# Altium schematic sheet mlx-brd1_091-sensor.SchDoc
size Letter
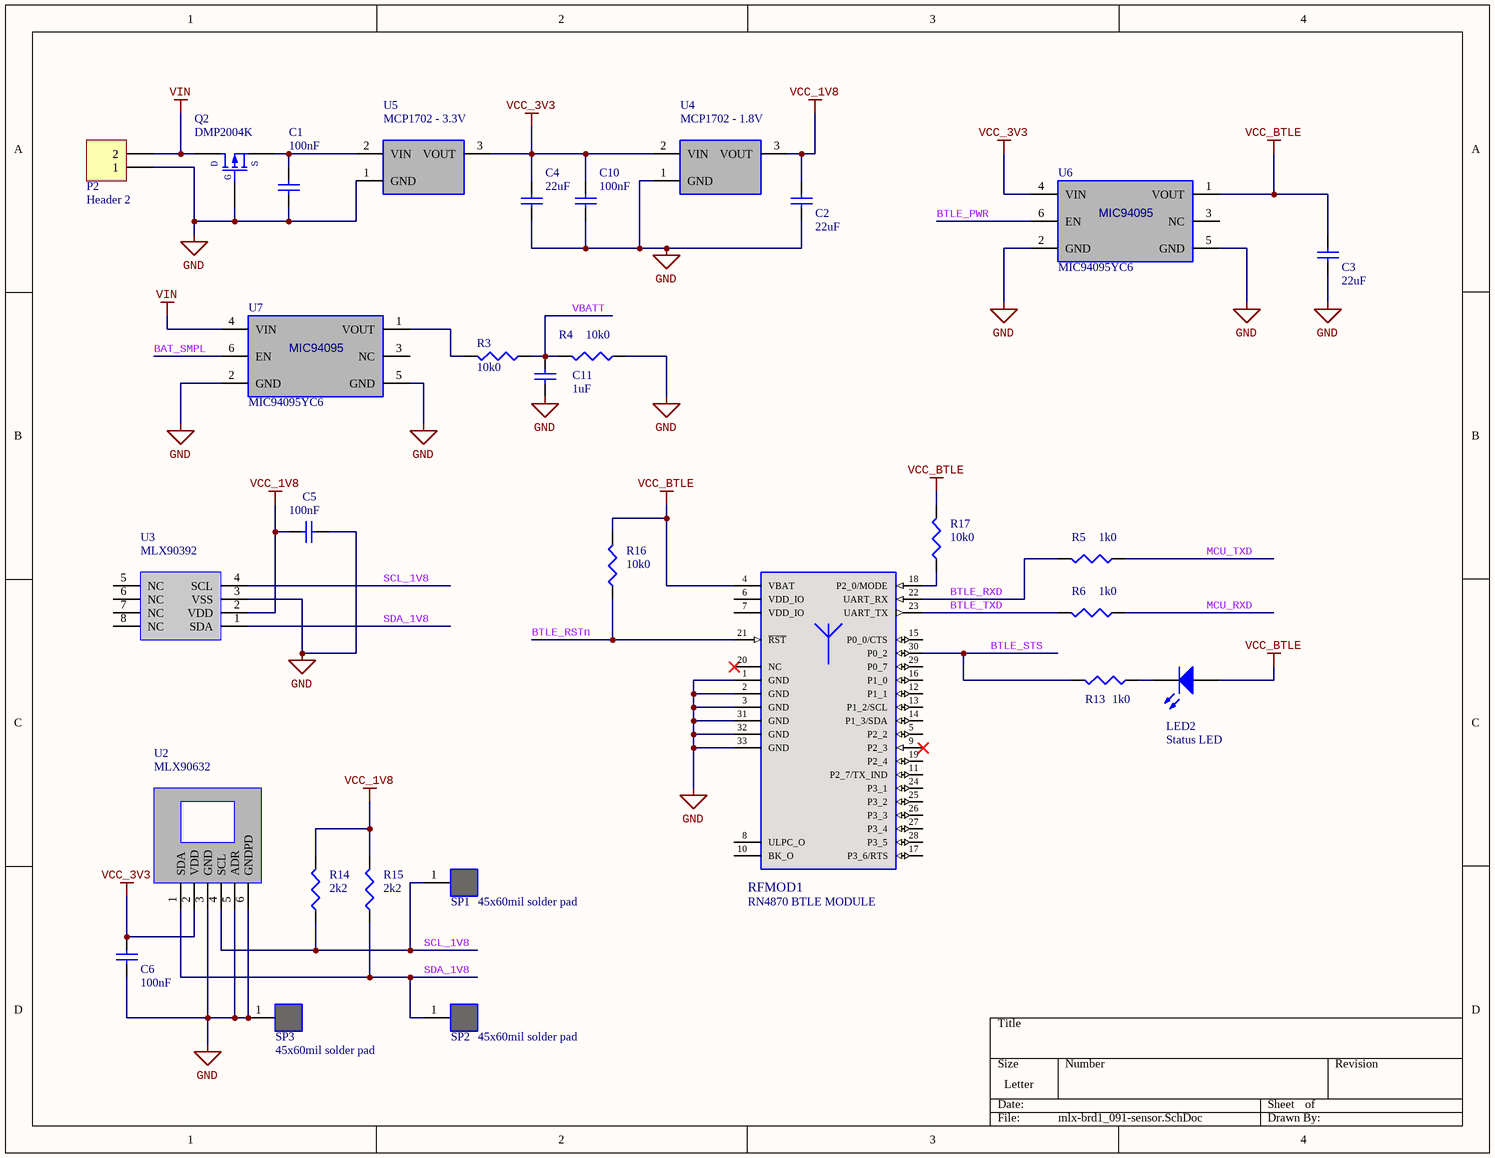
[diagram p0: mlx-brd1_091-sensor.SchDoc]

## Parts
C1  100nF  [CAPC1608N]
C2  22uF  [CAPC3216N]
C3  22uF  [CAPC3216N]
C4  22uF  [CAPC3216N]
C5  100nF  [CAPC1608N]
C6  100nF  [CAPC1608N]
C10  100nF  [CAPC1608N]
C11  1uF  [CAPC1608N]
LED2  Status LED  [3.2X1.6X1.1]
P2  Header 2  [HDR1X2]
Q2  DMP2004K  [SOT23-3N]
R3  10k0  [RESC1608N]
R4  10k0  [RESC1608N]
R5  1k0  [RESC1608N]
R6  1k0  [RESC1608N]
R13  1k0  [RESC1608N]
R14  2k2  [RESC1608N]
R15  2k2  [RESC1608N]
R16  10k0  [RESC1608N]
R17  10k0  [RESC1608N]
RFMOD1  RN4870 BTLE MODULE  [AP6-00539]
SP1  45x60mil solder pad  [sp45x60]
SP2  45x60mil solder pad  [sp45x60]
SP3  45x60mil solder pad  [sp45x60]
U2  MLX90632  [MLX90632_FIR_M2]
U3  MLX90392  [UTDFN8_2.5x2x0.4V2]
U4  MCP1702 - 1.8V  [MC1702-TO92]
U5  MCP1702 - 3.3V  [MC1702-TO92]
U6  MIC94095YC6  [SC-70]
U7  MIC94095YC6  [SC-70]

## Nets
GND: C1.1 C2.1 C3.1 C4.1 C5.1 C6.1 C10.1 C11.1 P2.1 Q2.1(G) R4.1 RFMOD1.1(GND) RFMOD1.2(GND) RFMOD1.3(GND) RFMOD1.31(GND) RFMOD1.32(GND) RFMOD1.33(GND) SP3.1 U2.3(GND) U2.5(ADR) U2.6(GNDPD) U3.3(VSS) U4.1(GND) U5.1(GND) U6.2(GND) U6.5(GND) U7.2(GND) U7.5(GND)
VCC_1V8: C2.2 C5.2 R14.2 R15.2 U3.2(VDD) U4.3(VOUT)
VCC_3V3: C4.2 C6.2 C10.2 U2.2(VDD) U4.2(VIN) U5.3(VOUT) U6.4(VIN)
VCC_BTLE: C3.2 LED2.1(A) R16.2 R17.2 RFMOD1.4(VBAT) U6.1(VOUT)
VIN: P2.2 Q2.3(D) U7.4(VIN)
BAT_SMPL: U7.6(EN)
BTLE_PWR: U6.6(EN)
BTLE_RSTn: R16.1 RFMOD1.21(~{RST})
BTLE_RXD: R5.2 RFMOD1.22(UART_RX)
BTLE_STS: R13.2 RFMOD1.30(P0_2)
BTLE_TXD: R6.2 RFMOD1.23(UART_TX)
MCU_RXD: R6.1
MCU_TXD: R5.1
SCL_1V8: R14.1 SP1.1 U2.4(SCL) U3.4(SCL)
SDA_1V8: R15.1 SP2.1 U2.1(SDA) U3.1(SDA)
VBATT: C11.2 R3.1 R4.2
NetC1_2: C1.2 Q2.2(S) U5.2(VIN)
NetLED2_2: LED2.2(K) R13.1
NetR3_2: R3.2 U7.1(VOUT)
NetR17_1: R17.1 RFMOD1.18(P2_0/MODE)

Not connected (* = marked no-connect by the designer): RFMOD1 5(P2_2) 6(VDD_IO) 7(VDD_IO) 8(ULPC_O) 9(P2_3)* 10(BK_O) 11(P2_7/TX_IND) 12(P1_1) 13(P1_2/SCL) 14(P1_3/SDA) 15(P0_0/CTS) 16(P1_0) 17(P3_6/RTS) 19(P2_4) 20(NC)* 24(P3_1) 25(P3_2) 26(P3_3) 27(P3_4) 28(P3_5) 29(P0_7); U3 5(NC) 6(NC) 7(NC) 8(NC); U6 3(NC); U7 3(NC)

## Notes on the sheet
- (in symbol MIC94095YC6) MIC94095

## Library data of the parts
C1 C5 C6 C10 = Cap: Capacitor; Manufacturer: Yageo; MPN: CC0603KPX7R9BB104; Value: CAP CER 0.1UF 50V X7R 0603; Digi-Key PN: 311-3567-1-ND
C2-C4 = Cap: Capacitor; Manufacturer: Yageo; MPN: CC1206MKX5R6BB226; Value: CAP CER 22UF 10V X5R 1206; Digi-Key PN: 311-1995-1-ND
C11 = Cap: Capacitor; Manufacturer: Taiyo Yuden; MPN: LMK107B7105KA-T; Value: CAP CER 1UF 10V X7R 0603; Digi-Key PN: 587-1242-1-ND
LED2 = LED1: Typical RED GaAs LED; Manufacturer: Inolux; MPN: IN-S126ATA; Value: LED AMBER CLEAR 1206 SMD; Digi-Key PN: 1830-1091-1-ND
P2 = Header 2: Header, 2-Pin; Digi-Key PN: n/a; Manufacturer: n/a; MPN: n/a; Value: n/a
Q2 = DMP2004K: P-Channel MOSFET; Manufacturer: Diodes Incorporated; MPN: DMP2004K-7; Value: MOSFET P-CH 20V 600MA SOT23-3; Digi-Key PN: DMP2004KDICT-ND
R3-R6 R13-R17 = Res3: Resistor; Manufacturer: Stackpole Electronics Inc; MPN: CF18JT10K0; Value: RES 10K OHM 1/8W 5% CF AXIAL; Digi-Key PN: CF18JT10K0CT-ND
RFMOD1 = RN4870-V: Bluetooth LE Module; Manufacturer: Microchip Technology; MPN: RN4870-V/RM140; Value: RX TXRX MODULE BLE CHIP SMD; Digi-Key PN: 150-RN4870-V/RM140-ND
SP1-SP3 = sp45x60
U2 = MLX90632-FIR: Manufacturer: Melexis; MPN: MLX90632-S-LD-DCB-100; Value: FIR sensor; Digi-Key PN: n/a
U3 = MLX90392-mag: Manufacturer: Melexis; MPN: MLX90392ELQ-AAA-010-RE; Value: 3D Magnetometer; Digi-Key PN: n/a
U4 = MCP1702-TO92: Manufacturer: Microchip Technology; MPN: MCP1702-3302E/TO; Value: Linear Voltage Regulator IC Positive Fixed 1 Output 250mA TO-92-3; Digi-Key PN: MCP1702-3302E/TO-ND
U5 = MCP1702-TO92: Manufacturer: Microchip Technology; MPN: MCP1702-1802E/TO; Value: Linear Voltage Regulator IC Positive Fixed 1 Output 200mA TO-92-3; Digi-Key PN: MCP1702-1802E/TO-ND
U6 U7 = MIC94095YC6: Manufacturer: Microchip Technology; MPN: MIC94095YC6-TR; Value: Power Switch/Driver 1:1 P-Channel 1.2A SC-70-6; Digi-Key PN: 576-3494-1-ND